# EAGLE schematic HF_front (EAGLE 6.4)
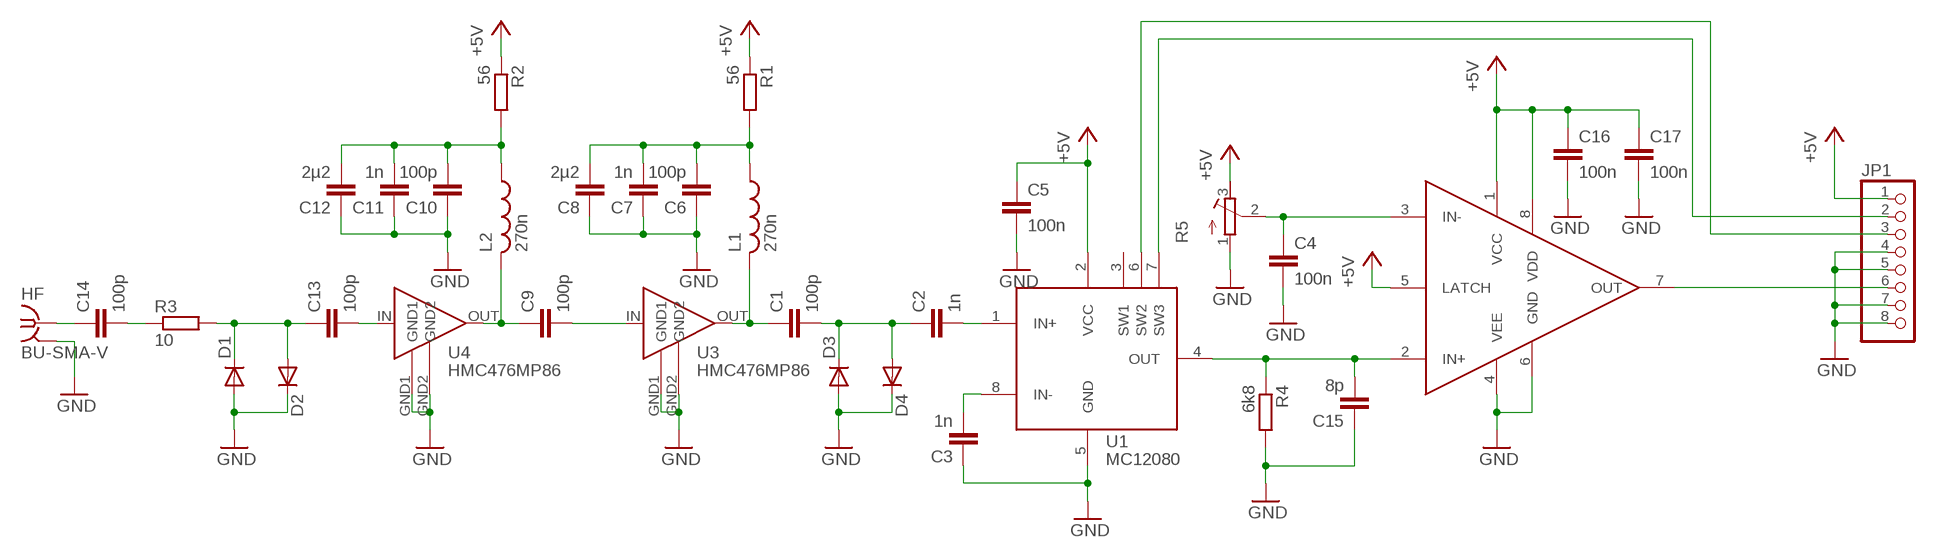
[diagram p0: schematic, sheet 1]

## Parts
C1  100p  C-EUC0603  [C0603]
C2  1n  C-EUC0603  [C0603]
C3  1n  C-EUC0603  [C0603]
C4  100n  C-EUC0603  [C0603]
C5  100n  C-EUC0603  [C0603]
C6  100p  C-EUC0603  [C0603]
C7  1n  C-EUC0603  [C0603]
C8  2µ2  C-EUC0603  [C0603]
C9  100p  C-EUC0603  [C0603]
C10  100p  C-EUC0603  [C0603]
C11  1n  C-EUC0603  [C0603]
C12  2µ2  C-EUC0603  [C0603]
C13  100p  C-EUC0603  [C0603]
C14  100p  C-EUC0603  [C0603]
C15  8p  C-EUC0603  [C0603]
C16  100n  C-EUC0603  [C0603]
C17  100n  C-EUC0603  [C0603]
D1  DIODE-SOD323-W  [SOD323-W]
D2  DIODE-SOD323-W  [SOD323-W]
D3  DIODE-SOD323-W  [SOD323-W]
D4  DIODE-SOD323-W  [SOD323-W]
HF  BU-SMA-V  [BU-SMA-V]
JP1  PINHD-1X8  [1X08]
L1  270n  INDUCTOR0603  [R0603]
L2  270n  INDUCTOR0603  [R0603]
R1  56  R-EU_R0603  [R0603]
R2  56  R-EU_R0603  [R0603]
R3  10  R-EU_R0603  [R0603]
R4  6k8  R-EU_R0603  [R0603]
R5  R-TRIMM64W  [RTRIM64W]
U1  MC12080  [SOIC8]
U2  MAX9203  [SOIC8]
U3  HMC476MP86  [MICRO-X]
U4  HMC476MP86  [MICRO-X]

## Nets
+5V: C5.1 C16.1 C17.1 JP1.1 R1.1 R2.1 R5.3(A) U1.2(VCC) U2.1(VCC) U2.5(LATCH) U2.8(VDD)
GND: C3.1 C4.2 C5.2 C6.1 C7.1 C8.1 C10.1 C11.1 C12.1 C15.1 C16.2 C17.2 D1.A D2.C D3.A D4.C HF.2 HF.3 HF.4 HF.5 JP1.4 JP1.5 JP1.7 JP1.8 R4.2 R5.1(E) U1.5(GND) U2.4(VEE) U2.6(GND) U3.GND1 U3.GND2 U4.GND1 U4.GND2
N$1: C6.2 C7.2 C8.2 L1.1 R1.2
N$2: C1.1 L1.2 U3.OUT
N$3: C10.2 C11.2 C12.2 L2.1 R2.2
N$4: C9.1 L2.2 U4.OUT
N$5: C9.2 U3.IN
N$6: C2.2 U1.1(IN+)
N$7: C3.2 U1.8(IN-)
N$8: C15.2 R4.1 U1.4(OUT) U2.2(IN+)
N$9: C4.1 R5.2(S) U2.3(IN-)
N$10: C14.1 HF.1
N$11: C14.2 R3.1
N$12: C13.1 D1.C D2.A R3.2
N$13: C13.2 U4.IN
N$14: C1.2 C2.1 D3.C D4.A
N$16: JP1.6 U2.7(OUT)
N$17: JP1.2 U1.7(SW3)
N$18: JP1.3 U1.6(SW2)
Unconnected: U1.3(SW1)

## Library data of the parts
C1-C17 = resistor:C-EU: CAPACITOR, European symbol
D1-D4 = diode:DIODE-: DIODE
HF = con-coax:BU-SMA-V: FEMALE SMA CONNECTOR Radiall distributor RS 112-3794; OC_FARNELL: unknown; OC_NEWARK: unknown
JP1 = pinhead:PINHD-1X8: PIN HEADER
L1 L2 = xmaker:INDUCTOR: Inductor
R1-R4 = resistor:R-EU_: RESISTOR, European symbol
R5 = resistor:R-TRIMM: Trimm resistor
U1 = dmm:MC12080
U2 = dmm:MAX9203
U3 U4 = dmm:HMC476MP86